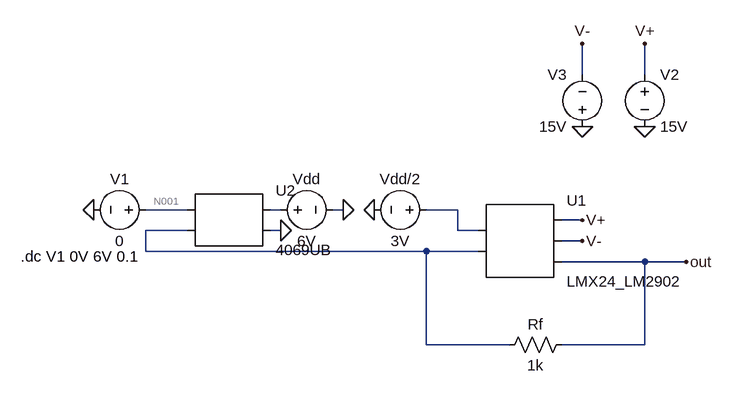
[diagram p0: schematic Ex1_q1.asc]
* Ex1_q1.asc
* U1: LMX24_LM2902 (symbol AutoGenerated\LMX24_LM2902 not available, pins judged from their places): pin1=N003 pin2=N004 pin3=V+ pin4=V- pin5=out
V1 N001 0 0
Vdd N002 0 6V
Vdd/2 N003 0 3V
Rf out N004 1k
V2 V+ 0 15V
V3 0 V- 15V
* U2: 4069UB (symbol AutoGenerated\4069UB not available, pins judged from their places): pin1=N001 pin2=N004 pin3=N002 pin4=0
.dc V1 0V 6V 0.1
.backanno
.end

* Results of the author's LTspice run, read from the files saved beside the schematic
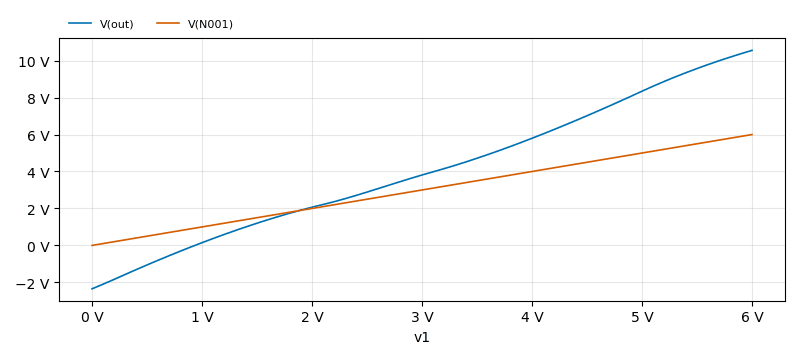
[diagram p1: DC transfer characteristic of Ex1_q1.asc, plotted from the saved traces]
* DC transfer characteristic, 1 run:
*   V(out): -2.349 V at v1=0 V, 10.56 V at v1=6 V, min -2.349 V, max 10.56 V
*   V(N001): 0 V at v1=0 V, 6 V at v1=6 V, min 0 V, max 6 V